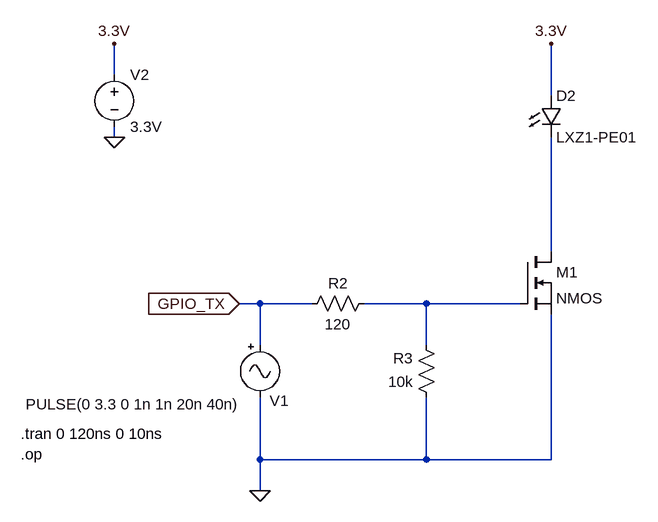
[diagram p0: schematic Simple Diode Driver Circuit.asc]
Simple Diode Driver Circuit.asc, the LTspice schematic file:
Version 4
SHEET 1 1100 680
WIRE 144 -144 144 -192
WIRE 816 -112 816 -192
WIRE 144 -48 144 -64
WIRE 816 128 816 -48
WIRE 368 208 336 208
WIRE 448 208 368 208
WIRE 624 208 528 208
WIRE 768 208 624 208
WIRE 368 272 368 208
WIRE 624 272 624 208
WIRE 368 448 368 352
WIRE 624 448 624 352
WIRE 624 448 368 448
WIRE 816 448 816 224
WIRE 816 448 624 448
WIRE 368 496 368 448
FLAG 144 -48 0
FLAG 368 496 0
FLAG 336 208 GPIO_TX
IOPIN 336 208 In
FLAG 144 -192 3.3V
FLAG 816 -192 3.3V
SYMBOL signal 368 256 R0
WINDOW 0 15 101 Left 2
WINDOW 3 -30 107 Right 2
SYMATTR InstName V1
SYMATTR Value PULSE(0 3.3 0 1n 1n 20n 40n)
SYMBOL voltage 144 -160 R0
SYMATTR InstName V2
SYMATTR Value 3.3V
SYMBOL LED 800 -112 R0
SYMATTR InstName D2
SYMATTR Value LXZ1-PE01
SYMBOL nmos 768 128 R0
SYMATTR InstName M1
SYMBOL Res 544 192 R90
WINDOW 0 0 56 VBottom 2
WINDOW 3 32 56 VTop 2
SYMATTR InstName R2
SYMATTR Value 120
SYMBOL Res 640 368 R180
WINDOW 0 36 76 Left 2
WINDOW 3 36 40 Left 2
SYMATTR InstName R3
SYMATTR Value 10k
TEXT 0 440 Left 2 !.op
TEXT 0 408 Left 2 !.tran 0 120ns 0 10ns

The netlist it stands for:
* Simple Diode Driver Circuit.asc
V1 GPIO_TX 0 PULSE(0 3.3 0 1n 1n 20n 40n)
V2 3.3V 0 3.3V
D2 3.3V N001 LXZ1-PE01
M1 N001 N002 0 0 NMOS
R2 N002 GPIO_TX 120
R3 0 N002 10k
.model D D
.lib standard.dio
.model NMOS NMOS
.model PMOS PMOS
.lib standard.mos
.op
.tran 0 120ns 0 10ns
.backanno
.end